# Altium schematic sheet ToolDoorController_edge.SchDoc: Tool Armoury Slave
size A4; DrawnBy: Luke Hovington; Organization: HSBNE; DocumentNumber: 1; Revision: 1.3; SheetNumber: 1; SheetTotal: 1; ProjectName: Tool Armoury Slave
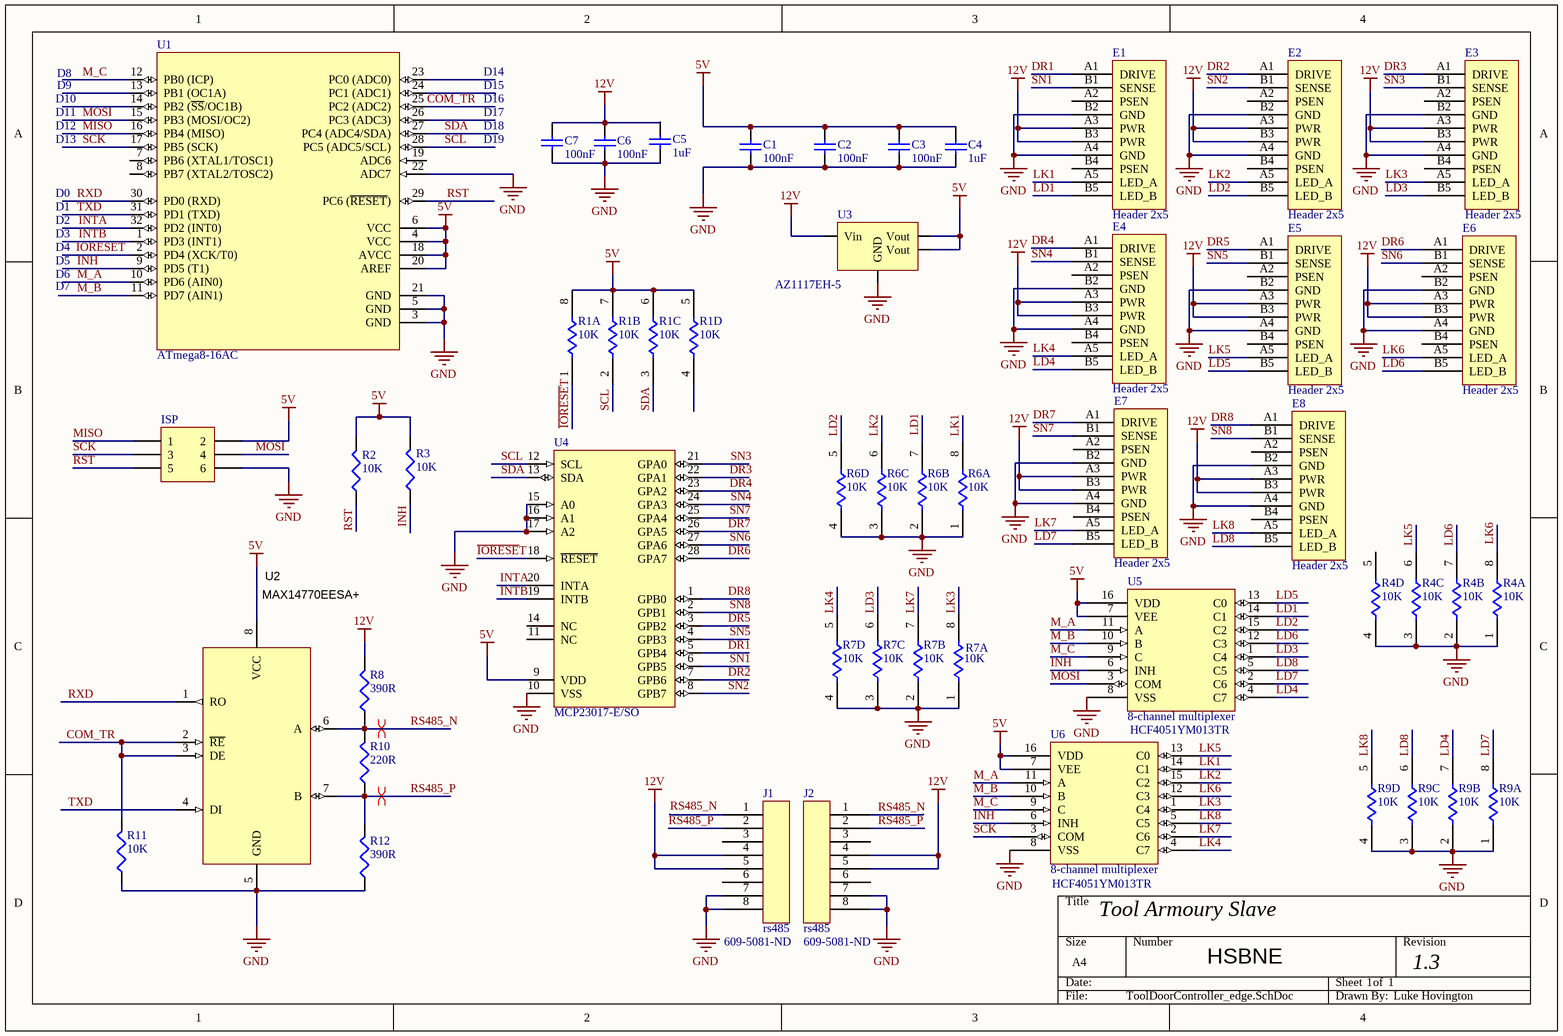
[diagram p0: ToolDoorController_edge.SchDoc]

## Parts
C1  100nF  [C1206]
C2  100nF  [C1206]
C3  100nF  [C1206]
C4  1uF  [C1206]
C5  1uF  [C1206]
C6  100nF  [C1206]
C7  100nF  [C1206]
E1  Header 2x5  [CARDEDGE CWR-170-10]
E2  Header 2x5  [CARDEDGE CWR-170-10]
E3  Header 2x5  [CARDEDGE CWR-170-10]
E4  Header 2x5  [CARDEDGE CWR-170-10]
E5  Header 2x5  [CARDEDGE CWR-170-10]
E6  Header 2x5  [CARDEDGE CWR-170-10]
E7  Header 2x5  [CARDEDGE CWR-170-10]
E8  Header 2x5  [CARDEDGE CWR-170-10]
ISP  ISP  [HDR2X3]  (value not drawn)
J1  rs485  Supplier Part Number 1: 609-5081-ND  [RJ45]
J2  rs485  Supplier Part Number 1: 609-5081-ND  [RJ45]
R1  10K  [SO8_S]  (parts A,B,C,D of 4)
R2  10K  [C1206]
R3  10K  [C1206]
R4  10K  [SO8_S]  (parts A,B,C,D of 4)
R6  10K  [SO8_S]  (parts A,B,C,D of 4)
R7  10K  [SO8_S]  (parts A,B,C,D of 4)
R8  390R  [C1206]  (no BOM)
R9  10K  [SO8_S]  (parts A,B,C,D of 4)
R10  220R  [C1206]  (no BOM)
R11  10K  [C1206]
R12  390R  [C1206]  (no BOM)
U1  ATmega8-16AC  [32A_N]
U2  MAX14770EESA+  [8S1_L]
U3  AZ1117EH-5  [SOT-223]
U4  MCP23017-E/SO  [SOIC-SO28_N]
U5  8-channel multiplexer  Manufacturer Part Number: HCF4051YM013TR  [16S1_M]
U6  8-channel multiplexer  Manufacturer Part Number: HCF4051YM013TR  [16S1_M]

## Nets
5V: C1.2 C2.2 C3.2 C4.2 ISP.2 R1.5 R1.6 R1.7 R1.8 R2.2 R3.2 U1.4(VCC) U1.6(VCC) U1.18(AVCC) U1.20(AREF) U2.8(VCC) U3.2(Vout) U3.4(Vout) U4.9(VDD) U5.7(VEE) U5.16(VDD) U6.7(VEE) U6.16(VDD)
12V: C5.2 C6.2 C7.2 E1.A3(PWR) E1.B3(PWR) E2.A3(PWR) E2.B3(PWR) E3.A3(PWR) E3.B3(PWR) E4.A3(PWR) E4.B3(PWR) E5.A3(PWR) E5.B3(PWR) E6.A3(PWR) E6.B3(PWR) E7.A3(PWR) E7.B3(PWR) E8.A3(PWR) E8.B3(PWR) J1.4 J1.5 J2.4 J2.5 R8.2 U3.3(Vin)
GND: C1.1 C2.1 C3.1 C4.1 C5.1 C6.1 C7.1 E1.A4(GND) E1.B2(GND) E2.A4(GND) E2.B2(GND) E3.A4(GND) E3.B2(GND) E4.A4(GND) E4.B2(GND) E5.A4(GND) E5.B2(GND) E6.A4(GND) E6.B2(GND) E7.A4(GND) E7.B2(GND) E8.A4(GND) E8.B2(GND) ISP.6 J1.7 J1.8 J2.7 J2.8 R4.1 R4.2 R4.3 R4.4 R6.1 R6.2 R6.3 R6.4 R7.1 R7.2 R7.3 R7.4 R9.1 R9.2 R9.3 R9.4 R11.1 R12.1 U1.3(GND) U1.5(GND) U1.21(GND) U1.22(ADC7) U2.5(GND) U3.1(GND) U4.10(VSS) U4.15(A0) U4.16(A1) U4.17(A2) U5.8(VSS) U6.8(VSS)
COM_TR: R11.2 U1.25(PC2_(ADC2)) U2.2(~{RE}) U2.3(DE)
DR1: E1.A1(DRIVE) U4.5(GPB4)
DR2: E2.A1(DRIVE) U4.7(GPB6)
DR3: E3.A1(DRIVE) U4.22(GPA1)
DR4: E4.A1(DRIVE) U4.23(GPA2)
DR5: E5.A1(DRIVE) U4.3(GPB2)
DR6: E6.A1(DRIVE) U4.28(GPA7)
DR7: E7.A1(DRIVE) U4.26(GPA5)
DR8: E8.A1(DRIVE) U4.1(GPB0)
~{IORESE}T: R1.1 U1.2(PD4_(XCK/T0)) U4.18(~{RESET})
INH: R3.1 U1.9(PD5_(T1)) U5.6(INH) U6.6(INH)
INTA: U1.32(PD2_(INT0)) U4.20(INTA)
INTB: U1.1(PD3_(INT1)) U4.19(INTB)
LD1: E1.B5(LED_B) R6.7 U5.14(C1)
LD2: E2.B5(LED_B) R6.5 U5.15(C2)
LD3: E3.B5(LED_B) R7.6 U5.1(C4)
LD4: E4.B5(LED_B) R9.7 U5.4(C7)
LD5: E5.B5(LED_B) U5.13(C0)
LD6: E6.B5(LED_B) R4.7 U5.12(C3)
LD7: E7.B5(LED_B) R9.8 U5.2(C6)
LD8: E8.B5(LED_B) R9.6 U5.5(C5)
LK1: E1.A5(LED_A) R6.8 U6.14(C1)
LK2: E2.A5(LED_A) R6.6 U6.15(C2)
LK3: E3.A5(LED_A) R7.8 U6.1(C4)
LK4: E4.A5(LED_A) R7.5 U6.4(C7)
LK5: E5.A5(LED_A) R4.6 U6.13(C0)
LK6: E6.A5(LED_A) R4.8 U6.12(C3)
LK7: E7.A5(LED_A) R7.7 U6.2(C6)
LK8: E8.A5(LED_A) R9.5 U6.5(C5)
M_A: U1.10(PD6_(AIN0)) U5.11(A) U6.11(A)
M_B: U1.11(PD7_(AIN1)) U5.10(B) U6.10(B)
M_C: U1.12(PB0_(ICP)) U5.9(C) U6.9(C)
MISO: ISP.1 U1.16(PB4_(MISO))
MOSI: ISP.4 U1.15(PB3_(MOSI/OC2)) U5.3(COM)
RS485_N: J1.1 J2.1 R8.1 R10.2 U2.6(A)
RS485_P: J1.2 J2.2 R10.1 R12.2 U2.7(B)
RST: ISP.5 R2.1 U1.29(PC6_(~{RESET}))
RXD: U1.30(PD0_(RXD)) U2.1(RO)
SCK: ISP.3 U1.17(PB5_(SCK)) U6.3(COM)
SCL: R1.2 U1.28(PC5_(ADC5/SCL)) U4.12(SCL)
SDA: R1.3 U1.27(PC4_(ADC4/SDA)) U4.13(SDA)
SN1: E1.B1(SENSE) U4.6(GPB5)
SN2: E2.B1(SENSE) U4.8(GPB7)
SN3: E3.B1(SENSE) U4.21(GPA0)
SN4: E4.B1(SENSE) U4.24(GPA3)
SN5: E5.B1(SENSE) U4.4(GPB3)
SN6: E6.B1(SENSE) U4.27(GPA6)
SN7: E7.B1(SENSE) U4.25(GPA4)
SN8: E8.B1(SENSE) U4.2(GPB1)
TXD: U1.31(PD1_(TXD)) U2.4(DI)

Not connected (* = marked no-connect by the designer): E1 A2(PSEN) B4(PSEN); E2 A2(PSEN) B4(PSEN); E3 A2(PSEN) B4(PSEN); E4 A2(PSEN) B4(PSEN); E5 A2(PSEN) B4(PSEN); E6 A2(PSEN) B4(PSEN); E7 A2(PSEN) B4(PSEN); E8 A2(PSEN) B4(PSEN); J1 3 6; J2 3 6; R1 4; R4 5; U1 7(PB6_(XTAL1/TOSC1)) 8(PB7_(XTAL2/TOSC2)) 13(PB1_(OC1A)) 14(PB2_(~{SS}/OC1B)) 19(ADC6) 23(PC0_(ADC0)) 24(PC1_(ADC1)) 26(PC3_(ADC3)); U4 11(NC) 14(NC)

## Layout directives
differential pair: RS485_N, RS485_P

## Notes on the sheet
- D10
- D11
- D8
- D9
- D14
- D15
- D16
- D17
- D12
- D13
- (near C7) D18
- (near C7) D19
- D0
- D1
- D3
- D4
- D2
- D5
- D6
- D7

## Library data of the parts
C1-C3 C6 C7 = Cap 100nF: Capacitor (Semiconductor SIM Model); Published: 8-Jun-2000; LatestRevisionDate: 29-May-2009; LatestRevisionNote: IPC-7351 Footprint Added.; PackageReference: C1206; Publisher: Altium Limited; PackageDescription: Chip Capacitor; Value: 100nF; Supplier 1: Digi-Key; Supplier 2: Mouser; Supplier Part Number 1: 399-1249-1-ND; Supplier Part Number 2: 80-C1206C104K5R
C4 C5 = Cap 1uF: Capacitor (Semiconductor SIM Model); Published: 8-Jun-2000; LatestRevisionDate: 29-May-2009; LatestRevisionNote: IPC-7351 Footprint Added.; PackageReference: C1206; Publisher: Altium Limited; PackageDescription: Chip Capacitor; Value: 1uF; Supplier 1: Mouser; Supplier 2: Digi-Key; Supplier Part Number 1: 80-C1206C105K5R; Supplier Part Number 2: 399-8150-1-ND
E1-E8 = Header 2x5: Header
ISP = Header 3X2: Header, 3-Pin, Dual row; LatestRevisionDate: 17-Jul-2002; LatestRevisionNote: Re-released for DXP Platform.; Publisher: Altium Limited; Supplier 1: Digi-Key; Supplier 2: Mouser; Supplier Part Number 1: 952-2121-ND; Supplier Part Number 2: 855-M20-9980346
J1 J2 = rj45: Supplier 1: Digi-Key
R1 R4 R6 R7 R9 = Resistor Pack: Isolated Resistor Network - Parts; Sim Note: Enter the Resistance value into parameter field.; Published: 24-Mar-1999; LatestRevisionDate: 29-May-2009; LatestRevisionNote: IPC-7351 Footprint Added.; PackageReference: SOIC16; Publisher: Altium Limited; PackageDescription: 16-Pin Small Outline Integrated Circuit 1.27 mm Pitch; Code_JEDEC: MS-012-AC; Code_IPC: SOIC127P600-16; Supplier 1: Digi-Key; Supplier 2: Mouser; Value: 10K
R2 R3 R11 = Resistor-10K: Resistor; Published: 8-Jun-2000; LatestRevisionDate: 29-May-2009; LatestRevisionNote: IPC-7351 Footprint Added.; PackageReference: J1-0603; Publisher: Altium Limited; PackageDescription: Chip Resistor; Value: 10K; Supplier 1: Digi-Key; Supplier 2: Mouser; Supplier Part Number 1: P10KECT-ND; Supplier Part Number 2: 71-CRCW1206-10K-E3
R8 R12 = Resistor-390R: Resistor; Published: 8-Jun-2000; LatestRevisionDate: 29-May-2009; LatestRevisionNote: IPC-7351 Footprint Added.; PackageReference: J1-0603; Publisher: Altium Limited; PackageDescription: Chip Resistor; Value: 390R; Supplier 1: Digi-Key; Supplier Part Number 1: RMCF1206JT390RCT-ND
R10 = Resistor-220R: Resistor; Published: 8-Jun-2000; LatestRevisionDate: 29-May-2009; LatestRevisionNote: IPC-7351 Footprint Added.; PackageReference: J1-0603; Publisher: Altium Limited; PackageDescription: Chip Resistor; Value: 220R; Supplier 1: Digi-Key; Supplier Part Number 1: RMCF1206JT220RCT-ND
U1 = ATmega8-16AC: 8-Bit AVR Microcontroller with 8K Bytes of In-System Programmable Flash Memory; Published: 17-Sep-2003; LatestRevisionDate: 16-Oct-2006; LatestRevisionNote: IPC-7351 Footprint Added.; DatasheetVersion: 2486H-AVR-09/02; PackageVersion: revB, Oct-2001; PackageReference: 32A; Publisher: Altium Limited; PackageDescription: 32-Lead, 7x7x1.0 mm Body, 0.8mm Lead Pitch, Thin Profile Plastic Quad Flat Package (TQFP); Supplier 1: Digi-Key; Supplier Part Number 1: ATMEGA8-16AC-ND; Supplier 2: Mouser; Supplier Part Number 2: 556-ATMEGA8-16AC; Code_JEDEC: MS-026-ABA; ComponentLink1Description: Datasheet; ComponentLink1URL: http://www.atmel.com/dyn/resources/prod_documents/doc2486.pdf; ComponentLink2Description: Atmel.com Home; ComponentLink2URL: http://www.atmel.com
U2 = MAX14770EESA+: TXRX PROFIBUS RS-485 8-SOIC; MPN: MAX14770EESA+; Supplier 1: Mouser; Supplier 2: Digi-Key; Supplier Part Number 1: 700-MAX14770EESA+; Supplier Part Number 2: MAX14770EESA+-ND
U3 = AZ1117EH: Reg 1A 5V OUT SIP VERT; Supplier 1: Digi-Key; Supplier Part Number 1: AZ1117EH-5.0TRG1DICT-ND
U4 = CMP-0186-00161-2: 16-Bit I/O Expander with Serial Interface, 28-Pin SOIC, Extended Temperature; PackageReference: SOIC-SO28; ComponentLink2URL: http://ww1.microchip.com/downloads/en/DeviceDoc/21952b.pdf; PackageVersion: revBB, Aug-2009; ComponentLink1URL: http://www.microchip.com/; Code_JEDEC: MS-013; ComponentLink2Description: Datasheet; DatasheetVersion: revB, Feb-2007; PackageDescription: 28-Lead Plastic Small Outline (SO) - Wide 7.50mm Body [SOIC]; ComponentLink3Description: Package Specification; ComponentLink1Description: Manufacturer URL; RevisionNote: URLs added.; ComponentLink3URL: http://www.microchip.com/stellent/groups/techpub_sg/documents/packagingspec/en012702.pdf
U5 U6 = 8-channel multiplexer: 8-channel analog multiplexer/demultiplexer; Supplier 1: Digi-Key; Supplier Part Number 1: 497-14372-1-ND